# EAGLE schematic Teensy-Long (EAGLE 9.5.2)

## Sheet 1 of 6
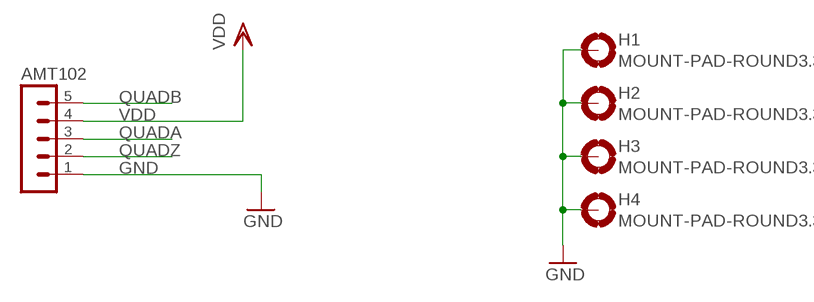
[diagram p0: schematic, sheet 1]

### Parts
AMT102  MA05-1  [MA05-1]
H1  MOUNT-PAD-ROUND3.3  [3,3-PAD]
H2  MOUNT-PAD-ROUND3.3  [3,3-PAD]
H3  MOUNT-PAD-ROUND3.3  [3,3-PAD]
H4  MOUNT-PAD-ROUND3.3  [3,3-PAD]

### Nets
GND: AMT102.1 H1.B3,3(MOUNT) H2.B3,3(MOUNT) H3.B3,3(MOUNT) H4.B3,3(MOUNT) ; also sheet 2,3,4,5,6
QUADA: AMT102.3 ; also sheet 6
QUADB: AMT102.5 ; also sheet 6
QUADZ: AMT102.2 ; also sheet 6
VDD: AMT102.4 ; also sheet 2,6

## Sheet 2 of 6
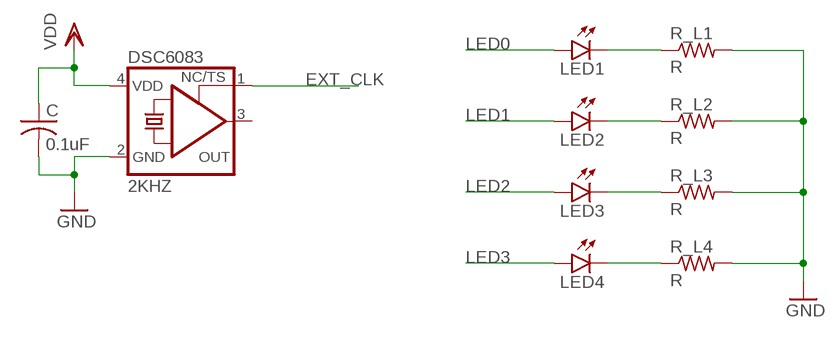
[diagram p1: schematic, sheet 2]

### Parts
C  0.1uF  C-USC0603  [C0603]
DSC6083  2KHZ  KXO-PXO/XO-V96  [3.2X2.5_KXO-V96]
LED1  LEDCHIP-LED0603  [CHIP-LED0603]
LED2  LEDCHIP-LED0603  [CHIP-LED0603]
LED3  LEDCHIP-LED0603  [CHIP-LED0603]
LED4  LEDCHIP-LED0603  [CHIP-LED0603]
R_L1  R  R-US_R0603  [R0603]
R_L2  R  R-US_R0603  [R0603]
R_L3  R  R-US_R0603  [R0603]
R_L4  R  R-US_R0603  [R0603]

### Nets
EXT_CLK: DSC6083.1(TS) ; also sheet 6
GND: C.2 DSC6083.2(GND) R_L1.2 R_L2.2 R_L3.2 R_L4.2 ; also sheet 1,3,4,5,6
LED0: LED1.A ; also sheet 6
LED1: LED2.A ; also sheet 6
LED2: LED3.A ; also sheet 6
LED3: LED4.A ; also sheet 6
N$1: LED1.C R_L1.1
N$2: LED2.C R_L2.1
N$5: LED3.C R_L3.1
N$6: LED4.C R_L4.1
VDD: C.1 DSC6083.4(VDD) ; also sheet 1,6
Unconnected: DSC6083.3(OUT)

## Sheet 3 of 6
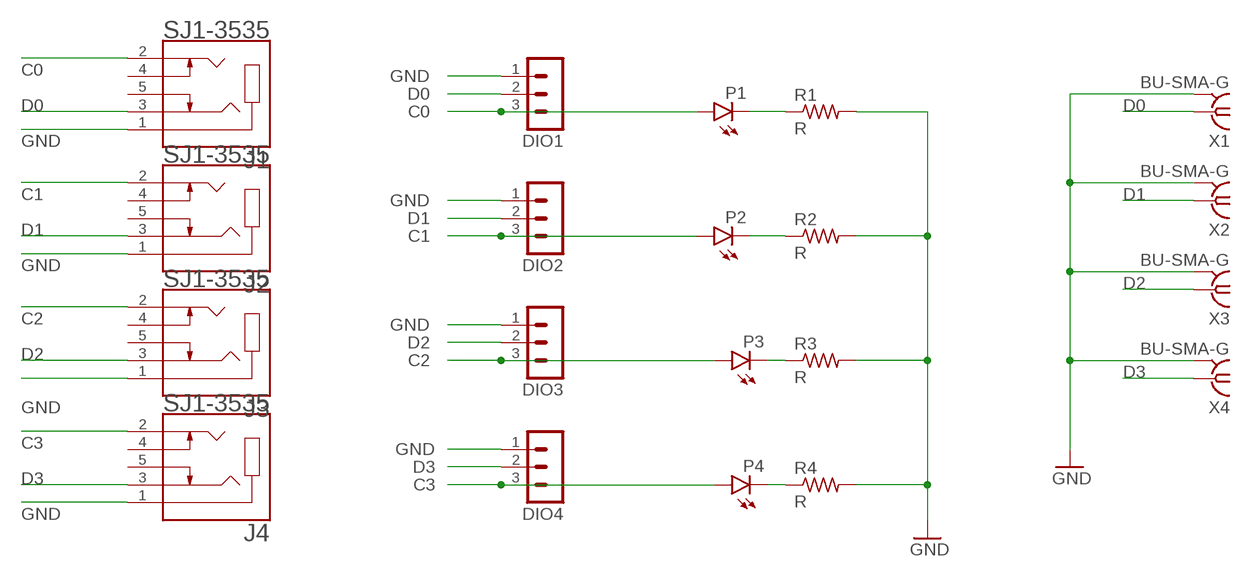
[diagram p2: schematic, sheet 3]

### Parts
DIO1  MA03-1  [MA03-1]
DIO2  MA03-1  [MA03-1]
DIO3  MA03-1  [MA03-1]
DIO4  MA03-1  [MA03-1]
J1  SJ1-3535  [CUI_SJ1-3535]
J2  SJ1-3535  [CUI_SJ1-3535]
J3  SJ1-3535  [CUI_SJ1-3535]
J4  SJ1-3535  [CUI_SJ1-3535]
P1  LEDCHIP-LED0603  [CHIP-LED0603]
P2  LEDCHIP-LED0603  [CHIP-LED0603]
P3  LEDCHIP-LED0603  [CHIP-LED0603]
P4  LEDCHIP-LED0603  [CHIP-LED0603]
R1  R  R-US_R0603  [R0603]
R2  R  R-US_R0603  [R0603]
R3  R  R-US_R0603  [R0603]
R4  R  R-US_R0603  [R0603]
X1  BU-SMA-G  [BU-SMA-G]
X2  BU-SMA-G  [BU-SMA-G]
X3  BU-SMA-G  [BU-SMA-G]
X4  BU-SMA-G  [BU-SMA-G]

### Nets
C0: DIO1.3 J1.2 P1.A ; also sheet 6
C1: DIO2.3 J2.2 P2.A ; also sheet 6
C2: DIO3.3 J3.2 P3.A ; also sheet 6
C3: DIO4.3 J4.2 P4.A ; also sheet 6
D0: DIO1.2 J1.3 X1.1 ; also sheet 6
D1: DIO2.2 J2.3 X2.1 ; also sheet 6
D2: DIO3.2 J3.3 X3.1 ; also sheet 6
D3: DIO4.2 J4.3 X4.1 ; also sheet 6
GND: DIO1.1 DIO2.1 DIO3.1 DIO4.1 J1.1 J2.1 J3.1 J4.1 R1.2 R2.2 R3.2 R4.2 X1.2 X1.3 X1.4 X1.5 X2.2 X2.3 X2.4 X2.5 X3.2 X3.3 X3.4 X3.5 X4.2 X4.3 X4.4 X4.5 ; also sheet 1,2,4,5,6
N$4: P1.C R1.1
N$7: P2.C R2.1
N$8: P3.C R3.1
N$9: P4.C R4.1
Unconnected: J1.4 J1.5 J2.4 J2.5 J3.4 J3.5 J4.4 J4.5

## Sheet 4 of 6
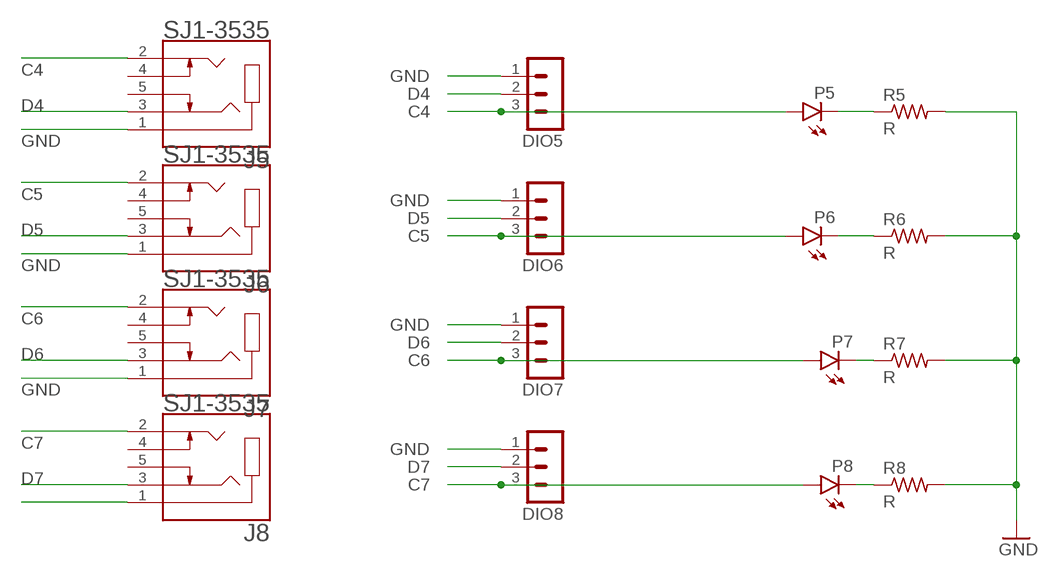
[diagram p3: schematic, sheet 4]

### Parts
DIO5  MA03-1  [MA03-1]
DIO6  MA03-1  [MA03-1]
DIO7  MA03-1  [MA03-1]
DIO8  MA03-1  [MA03-1]
J5  SJ1-3535  [CUI_SJ1-3535]
J6  SJ1-3535  [CUI_SJ1-3535]
J7  SJ1-3535  [CUI_SJ1-3535]
J8  SJ1-3535  [CUI_SJ1-3535]
P5  LEDCHIP-LED0603  [CHIP-LED0603]
P6  LEDCHIP-LED0603  [CHIP-LED0603]
P7  LEDCHIP-LED0603  [CHIP-LED0603]
P8  LEDCHIP-LED0603  [CHIP-LED0603]
R5  R  R-US_R0603  [R0603]
R6  R  R-US_R0603  [R0603]
R7  R  R-US_R0603  [R0603]
R8  R  R-US_R0603  [R0603]

### Nets
C4: DIO5.3 J5.2 P5.A ; also sheet 6
C5: DIO6.3 J6.2 P6.A ; also sheet 6
C6: DIO7.3 J7.2 P7.A ; also sheet 6
C7: DIO8.3 J8.2 P8.A ; also sheet 6
D4: DIO5.2 J5.3 ; also sheet 6
D5: DIO6.2 J6.3 ; also sheet 6
D6: DIO7.2 J7.3 ; also sheet 6
D7: DIO8.2 J8.3 ; also sheet 6
GND: DIO5.1 DIO6.1 DIO7.1 DIO8.1 J5.1 J6.1 J7.1 J8.1 R5.2 R6.2 R7.2 R8.2 ; also sheet 1,2,3,5,6
N$3: P5.C R5.1
N$10: P6.C R6.1
N$11: P7.C R7.1
N$12: P8.C R8.1
Unconnected: J5.4 J5.5 J6.4 J6.5 J7.4 J7.5 J8.4 J8.5

## Sheet 5 of 6
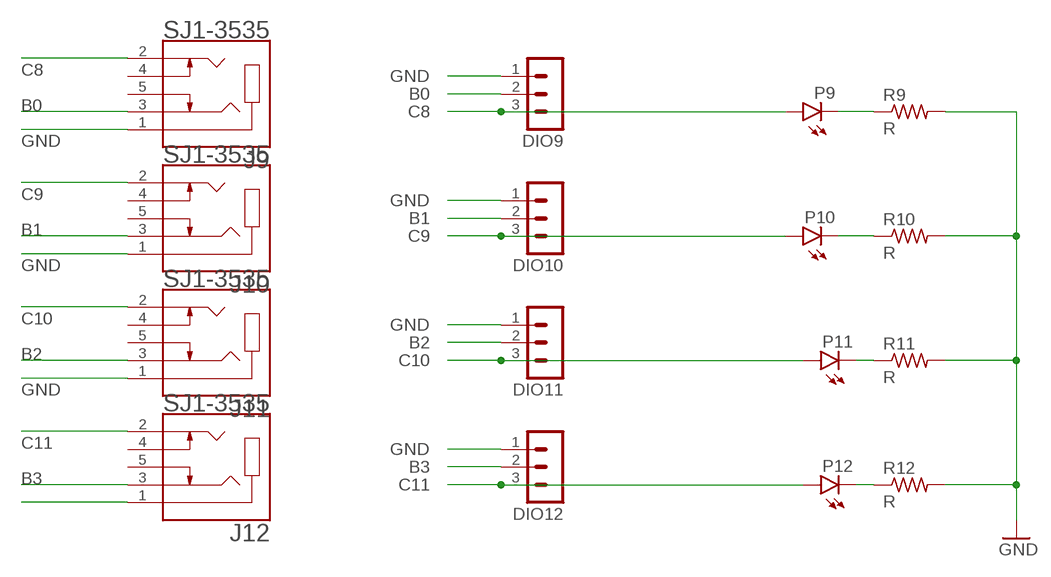
[diagram p4: schematic, sheet 5]

### Parts
DIO9  MA03-1  [MA03-1]
DIO10  MA03-1  [MA03-1]
DIO11  MA03-1  [MA03-1]
DIO12  MA03-1  [MA03-1]
J9  SJ1-3535  [CUI_SJ1-3535]
J10  SJ1-3535  [CUI_SJ1-3535]
J11  SJ1-3535  [CUI_SJ1-3535]
J12  SJ1-3535  [CUI_SJ1-3535]
P9  LEDCHIP-LED0603  [CHIP-LED0603]
P10  LEDCHIP-LED0603  [CHIP-LED0603]
P11  LEDCHIP-LED0603  [CHIP-LED0603]
P12  LEDCHIP-LED0603  [CHIP-LED0603]
R9  R  R-US_R0603  [R0603]
R10  R  R-US_R0603  [R0603]
R11  R  R-US_R0603  [R0603]
R12  R  R-US_R0603  [R0603]

### Nets
B0: DIO9.2 J9.3 ; also sheet 6
B1: DIO10.2 J10.3 ; also sheet 6
B2: DIO11.2 J11.3 ; also sheet 6
B3: DIO12.2 J12.3 ; also sheet 6
C8: DIO9.3 J9.2 P9.A ; also sheet 6
C9: DIO10.3 J10.2 P10.A ; also sheet 6
C10: DIO11.3 J11.2 P11.A ; also sheet 6
C11: DIO12.3 J12.2 P12.A ; also sheet 6
GND: DIO9.1 DIO10.1 DIO11.1 DIO12.1 J9.1 J10.1 J11.1 J12.1 R9.2 R10.2 R11.2 R12.2 ; also sheet 1,2,3,4,6
N$13: P9.C R9.1
N$14: P10.C R10.1
N$15: P11.C R11.1
N$16: P12.C R12.1
Unconnected: J9.4 J9.5 J10.4 J10.5 J11.4 J11.5 J12.4 J12.5

## Sheet 6 of 6
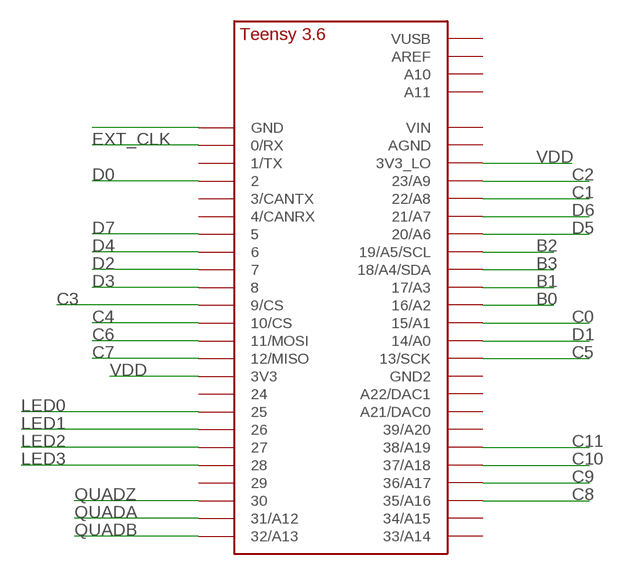
[diagram p5: schematic, sheet 6]

### Parts
U$3  TEENSY_3.5/3.6_BASIC  [TEENSY_3.5/3.6_BASIC]

### Nets
B0: U$3.16/A2 ; also sheet 5
B1: U$3.17/A3 ; also sheet 5
B2: U$3.19/A5/SCL ; also sheet 5
B3: U$3.18/A4/SDA ; also sheet 5
C0: U$3.15/A1 ; also sheet 3
C1: U$3.22/A8 ; also sheet 3
C2: U$3.23/A9 ; also sheet 3
C3: U$3.9/CS ; also sheet 3
C4: U$3.10/CS ; also sheet 4
C5: U$3.13/SCK ; also sheet 4
C6: U$3.11/MOSI ; also sheet 4
C7: U$3.12/MISO ; also sheet 4
C8: U$3.35/A16 ; also sheet 5
C9: U$3.36/A17 ; also sheet 5
C10: U$3.37/A18 ; also sheet 5
C11: U$3.38/A19 ; also sheet 5
D0: U$3.2 ; also sheet 3
D1: U$3.14/A0 ; also sheet 3
D2: U$3.7 ; also sheet 3
D3: U$3.8 ; also sheet 3
D4: U$3.6 ; also sheet 4
D5: U$3.20/A6 ; also sheet 4
D6: U$3.21/A7 ; also sheet 4
D7: U$3.5 ; also sheet 4
EXT_CLK: U$3.0/RX ; also sheet 2
GND: U$3.GND ; also sheet 1,2,3,4,5
LED0: U$3.25 ; also sheet 2
LED1: U$3.26 ; also sheet 2
LED2: U$3.27 ; also sheet 2
LED3: U$3.28 ; also sheet 2
QUADA: U$3.31/A12 ; also sheet 1
QUADB: U$3.32/A13 ; also sheet 1
QUADZ: U$3.30 ; also sheet 1
VDD: U$3.3V3 U$3.3V3_LO ; also sheet 1,2
Unconnected: U$3.1/TX U$3.3/CANTX U$3.4/CANRX U$3.21/DAC0(A21/DAC0) U$3.24 U$3.29 U$3.33/A14 U$3.34/A15 U$3.39/A20 U$3.A10 U$3.A11 U$3.A22/DAC1 U$3.AGND U$3.AREF U$3.GND2 U$3.VIN U$3.VUSB

## Library data of the parts
AMT102 = con-lstb-mod:MA05-1: PIN HEADER; OC_FARNELL: unknown; OC_NEWARK: unknown
C = rcl:C-US: CAPACITOR, American symbol; SPICEPREFIX: C
DIO1-DIO12 = con-lstb:MA03-1: PIN HEADER; OC_FARNELL: unknown; OC_NEWARK: unknown
DSC6083 = crystal-geyer_V1_0:KXO-PXO/XO-V: Clock Oscillator (PXO/XO) MHz : KXO-V - Serie Model Size l/w/h [mm] Frequency Range Frequency Stability Temp. Range [°C] Output AECQ 200 availabel Datasheet KXO-V94 KXO-V94 KXO-V95 KXO-V95 KXO-V96 KXO-V96 KXO-V99 KXO-V99 KXO-97 KXO-V97 KXO-97 - KXO-V97 2.0/1.6/0.80 2.0/1.6/0.80 2.5/2.0/0.82 2.5/2.0/0.82 3.2/2.5/1.2 3.2/2.5/1.2 5.0/3.2/1.2 5.0/3.2/1.2 7.0/5.08/1.3 7.0/5.08/1.3 7.0/5.08/1.3 32,768 kHz 1,0 ~ 80,0 MHz 32,768 kHz 1,0 ~ 70,0 MHz 32,768 kHz 1,0 ~ 156,0 MHz 32,768 kHz 1,0 ~ 200,0 MHz 32,768 kHz 32,768 kHz 1,0 ~ 160,0 MHz ±25 … ±100ppm ±25 … ±100ppm ±25 … ±100ppm ±25 … ±100ppm ±25 … ±100ppm ±25 … ±100ppm ±25 … ±100ppm ±25 … ±100ppm ±25 … ±100ppm ±25 … ±100ppm ±25 … ±100ppm (*) -40°C …+85°C (*) -40°C …+85°C (*) -40°C …+85°C (*) -40°C …+85°C (*) -40°C …+85°C (*) -40°C …+85°C (*) -40°C …+85°C (*) -40°C …+85°C (*) -40°C …+85°C (*) -40°C …+85°C (*) -40°C …+85°C HCMOS HCMOS HCMOS HCMOS HCMOS HCMOS HCMOS HCMOS HCMOS HCMOS HCMOS - - yes yes yes yes - - - - - KXO-V94-kHz.pdf <http://www.geyer-electronic.de/uploads/tx_userartikelfrequenz/GEYER-KXO-V94-kHz.pdf> KXO-V94.pdf <http://www.geyer-electronic.de/uploads/tx_userartikelfrequenz/GEYER-KXO-V94.pdf> KXO-V95-kHz.pdf <http://www.geyer-electronic.de/uploads/tx_userartikelfrequenz/GEYER-KXO-V95-kHz.pdf> KXO-V95.pdf <http://www.geyer-electronic.de/uploads/tx_userartikelfrequenz/GEYER-KXO-V95.pdf> KXO-V96-kHz.pdf <http://www.geyer-electronic.de/uploads/tx_userartikelfrequenz/GEYER-KXO-V96-kHz.pdf> KXO-V96.pdf <http://www.geyer-electronic.de/uploads/tx_userartikelfrequenz/GEYER-KXO-V96.pdf> KXO-V99-kHz.pdf <http://www.geyer-electronic.de/uploads/tx_userartikelfrequenz/GEYER-KXO-V99-kHz.pdf> KXO-V99.pdf <http://www.geyer-electronic.de/uploads/tx_userartikelfrequenz/GEYER-KXO-V99.pdf> KXO-97-kHz.pdf <http://www.geyer-electronic.de/uploads/tx_userartikelfrequenz/GEYER-KXO-97-kHz.pdf> KXO-V97-kHz.pdf <http://www.geyer-electronic.de/uploads/tx_userartikelfrequenz/GEYER-KXO-V97-kHz.pdf> KXO-V97.pdf <http://www.geyer-electronic.de/uploads/tx_userartikelfrequenz/GEYER-KXO-V97.pdf> <http://www.geyer-electronic.de/fileadmin/template/img/logo-geyer-electronic.png> Details see: http://www.geyer-electronic.de/Frequenz-Produkte.9.0.html Created 2016-06-07, Hans Locher 2016 (C) Geyer Quartz Technology Hans Locher KXOV94,KXOV95;KXOV96;KXOV97;KXO97;2016;2520;3225;5032;70508;2,5x2,0;3,2x2,5;5,0x3,2;7,0x5,08;2.5x2.0;3.2x2.5;5.0x3.2;7.0x5.08;
H1-H4 = holes:MOUNT-PAD-ROUND: MOUNTING PAD, round
J1-J12 = SJ1-3535:SJ1-3535: 1.5 Meter Black 3.5 mm Stereo Male to 3.5 mm Stereo Male Connection Cable; AVAILABILITY: Unavailable; CUI_PURCHASE_URL: https://www.cuidevices.com/product/interconnect/connectors/audio-connectors/jacks/sj1-353x-series?utm_source=snapeda.com&utm_medium=referral&utm_campaign=snapedaBOM; DESCRIPTION: 3.5 mm, Stereo, Right Angle, Through Hole, Threaded Bushing, Audio Jack Connector; MF: CUI Devices; MP: SJ1-3535; PACKAGE: None; PRICE: None
LED1-LED4 P1-P12 = led:LED: LED OSRAM: - CHIPLED LG R971, LG N971, LY N971, LG Q971, LY Q971, LO R971, LY R971 LH N974, LH R974 LS Q976, LO Q976, LY Q976 LO Q996 - Hyper CHIPLED LW Q18S LB Q993, LB Q99A, LB R99A - SideLED LS A670, LO A670, LY A670, LG A670, LP A670 LB A673, LV A673, LT A673, LW A673 LH A674 LY A675 LS A676, LA A676, LO A676, LY A676, LW A676 LS A679, LY A679, LG A679 - Hyper Micro SIDELED® LS Y876, LA Y876, LO Y876, LY Y876 LT Y87S - SmartLED LW L88C, LW L88S LB L89C, LB L89S, LG L890 LS L89K, LO L89K, LY L89K LS L896, LA L896, LO L896, LY L896 - TOPLED LS T670, LO T670, LY T670, LG T670, LP T670 LSG T670, LSP T670, LSY T670, LOP T670, LYG T670 LG T671, LOG T671, LSG T671 LB T673, LV T673, LT T673, LW T673 LH T674 LS T676, LA T676, LO T676, LY T676, LB T676, LH T676, LSB T676, LW T676 LB T67C, LV T67C, LT T67C, LS T67K, LO T67K, LY T67K, LW E67C LS E67B, LA E67B, LO E67B, LY E67B, LB E67C, LV E67C, LT E67C LW T67C LS T679, LY T679, LG T679 LS T770, LO T770, LY T770, LG T770, LP T770 LB T773, LV T773, LT T773, LW T773 LH T774 LS E675, LA E675, LY E675, LS T675 LS T776, LA T776, LO T776, LY T776, LB T776 LHGB T686 LT T68C, LB T68C - Hyper Mini TOPLED® LB M676 - Mini TOPLED Santana® LG M470 LS M47K, LO M47K, LY M47K Source: http://www.osram.convergy.de LUXEON: - LUMILED® LXK2-PW12-R00, LXK2-PW12-S00, LXK2-PW14-U00, LXK2-PW14-V00 LXK2-PM12-R00, LXK2-PM12-S00, LXK2-PM14-U00 LXK2-PE12-Q00, LXK2-PE12-R00, LXK2-PE12-S00, LXK2-PE14-T00, LXK2-PE14-U00 LXK2-PB12-K00, LXK2-PB12-L00, LXK2-PB12-M00, LXK2-PB14-N00, LXK2-PB14-P00, LXK2-PB14-Q00 LXK2-PR12-L00, LXK2-PR12-M00, LXK2-PR14-Q00, LXK2-PR14-R00 LXK2-PD12-Q00, LXK2-PD12-R00, LXK2-PD12-S00 LXK2-PH12-R00, LXK2-PH12-S00 LXK2-PL12-P00, LXK2-PL12-Q00, LXK2-PL12-R00 Source: www.luxeon.com KINGBRIGHT: KA-3528ASYC Source: www.kingbright.com
R1-R12 R_L1-R_L4 = rcl:R-US_: RESISTOR, American symbol; SPICEPREFIX: R
U$3 = Teensy356:TEENSY_3.5/3.6_BASIC
X1-X4 = con-coax:BU-SMA-G: FEMALE SMA CONNECTOR Radiall distributor RS 193-9117; OC_FARNELL: unknown; OC_NEWARK: unknown

## Net classes
0 default: clearance 0.205 mm